# Altium schematic sheet connector.SchDoc
size A4; SheetNumber: 2; SheetTotal: 4
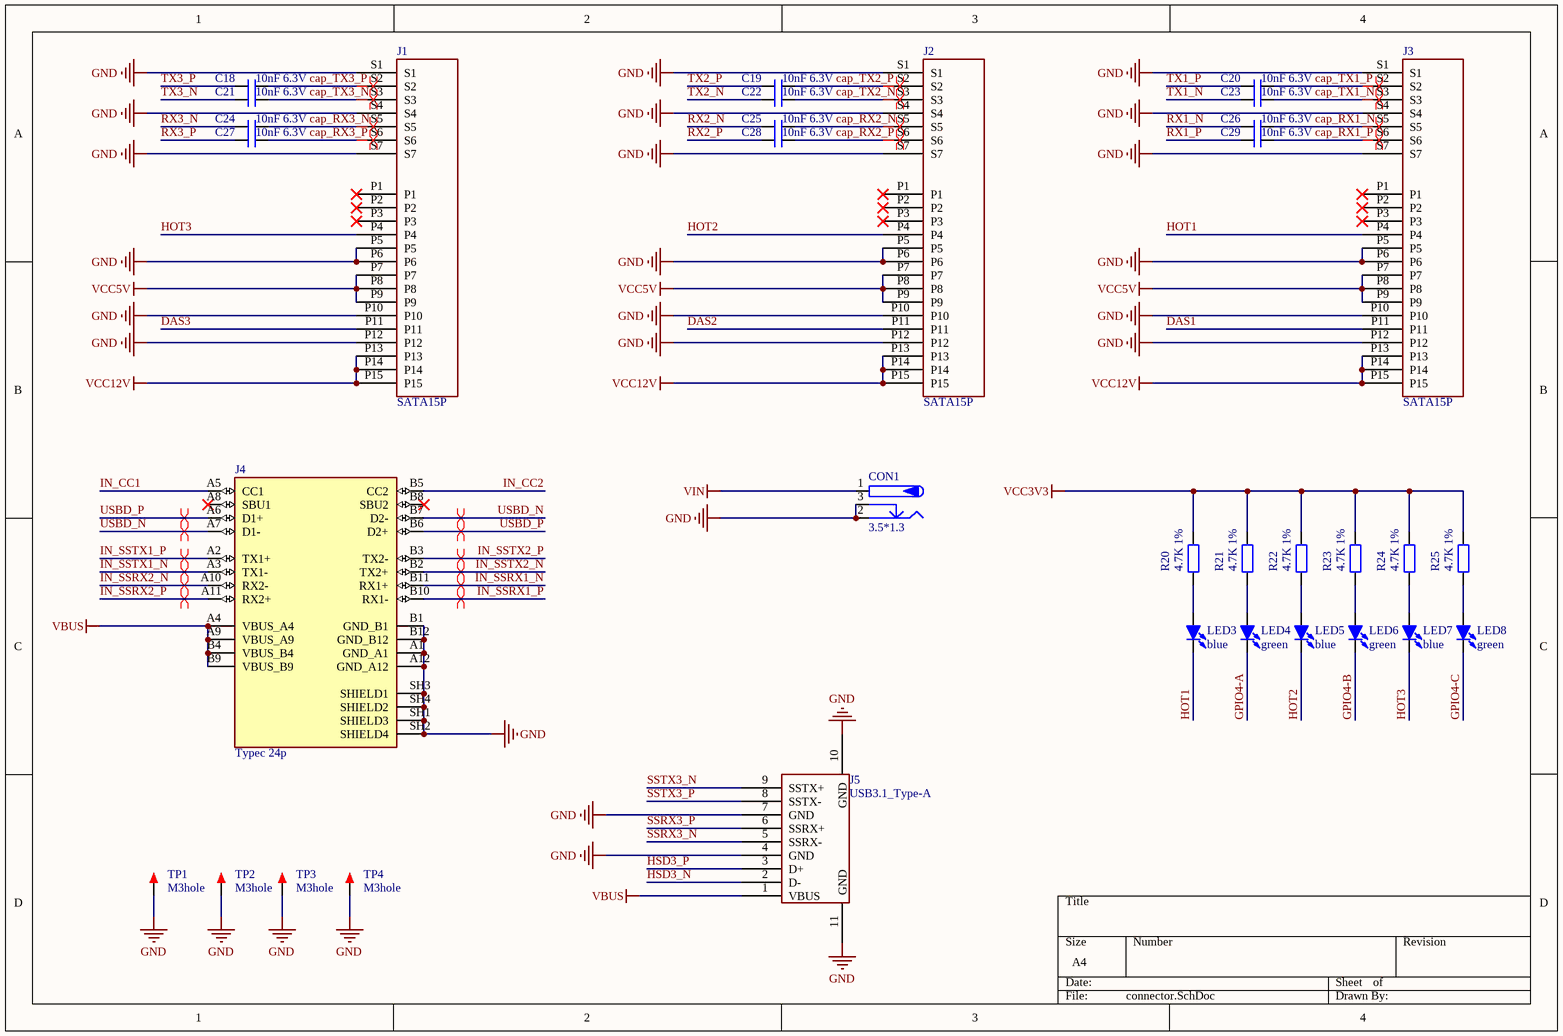
[diagram p0: connector.SchDoc]

## Parts
C18  10nF 6.3V  [C0402_L]
C19  10nF 6.3V  [C0402_L]
C20  10nF 6.3V  [C0402_L]
C21  10nF 6.3V  [C0402_L]
C22  10nF 6.3V  [C0402_L]
C23  10nF 6.3V  [C0402_L]
C24  10nF 6.3V  [C0402_L]
C25  10nF 6.3V  [C0402_L]
C26  10nF 6.3V  [C0402_L]
C27  10nF 6.3V  [C0402_L]
C28  10nF 6.3V  [C0402_L]
C29  10nF 6.3V  [C0402_L]
CON1  3.5*1.3  [DC-012]
J1  SATA15P  [SATA 15P 贴片]
J2  SATA15P  [SATA 15P 贴片]
J3  SATA15P  [SATA 15P 贴片]
J4  Typec 24p  [TypeC 24p 直立]
J5  USB3.1_Type-A  [USB3.1_Type-A 立式直插]
LED3  blue  [LED 0805B]
LED4  green  [LED 0805G]
LED5  blue  [LED 0805B]
LED6  green  [LED 0805G]
LED7  blue  [LED 0805B]
LED8  green  [LED 0805G]
R20  4.7K 1%  [R0402_L]
R21  4.7K 1%  [R0402_L]
R22  4.7K 1%  [R0402_L]
R23  4.7K 1%  [R0402_L]
R24  4.7K 1%  [R0402_L]
R25  4.7K 1%  [R0402_L]
TP1  M3hole  [m3内嵌螺母贴片]
TP2  M3hole  [m3内嵌螺母贴片]
TP3  M3hole  [m3内嵌螺母贴片]
TP4  M3hole  [m3内嵌螺母贴片]

## Nets
GND: CON1.2 CON1.3 J1.P5 J1.P6 J1.P10 J1.P12 J1.S1 J1.S4 J1.S7 J2.P5 J2.P6 J2.P10 J2.P12 J2.S1 J2.S4 J2.S7 J3.P5 J3.P6 J3.P10 J3.P12 J3.S1 J3.S4 J3.S7 J4.A1(GND_A1) J4.A12(GND_A12) J4.B1(GND_B1) J4.B12(GND_B12) J4.SH1(SHIELD3) J4.SH2(SHIELD4) J4.SH3(SHIELD1) J4.SH4(SHIELD2) J5.4(GND) J5.7(GND) J5.10(GND) J5.11(GND) TP1.1 TP2.1 TP3.1 TP4.1
VBUS: J4.A4(VBUS_A4) J4.A9(VBUS_A9) J4.B4(VBUS_B4) J4.B9(VBUS_B9) J5.1(VBUS)
VCC3V3: R20.1 R21.1 R22.1 R23.1 R24.1 R25.1
VCC5V: J1.P7 J1.P8 J1.P9 J2.P7 J2.P8 J2.P9 J3.P7 J3.P8 J3.P9
VCC12V: J1.P13 J1.P14 J1.P15 J2.P13 J2.P14 J2.P15 J3.P13 J3.P14 J3.P15
VIN: CON1.1
cap_RX1_N: C26.1 J3.S5
cap_RX1_P: C29.1 J3.S6
cap_RX2_N: C25.1 J2.S5
cap_RX2_P: C28.1 J2.S6
cap_RX3_N: C24.1 J1.S5
cap_RX3_P: C27.1 J1.S6
cap_TX1_N: C23.1 J3.S3
cap_TX1_P: C20.1 J3.S2
cap_TX2_N: C22.1 J2.S3
cap_TX2_P: C19.1 J2.S2
cap_TX3_N: C21.1 J1.S3
cap_TX3_P: C18.1 J1.S2
DAS1: J3.P11
DAS2: J2.P11
DAS3: J1.P11
GPIO4-A: LED4.2(K)
GPIO4-B: LED6.2(K)
GPIO4-C: LED8.2(K)
HOT1: J3.P4 LED3.2(K)
HOT2: J2.P4 LED5.2(K)
HOT3: J1.P4 LED7.2(K)
HSD3_N: J5.2(D-)
HSD3_P: J5.3(D+)
IN_CC1: J4.A5(CC1)
IN_CC2: J4.B5(CC2)
IN_SSRX1_N: J4.B11(RX1+)
IN_SSRX1_P: J4.B10(RX1-)
IN_SSRX2_N: J4.A10(RX2-)
IN_SSRX2_P: J4.A11(RX2+)
IN_SSTX1_N: J4.A3(TX1-)
IN_SSTX1_P: J4.A2(TX1+)
IN_SSTX2_N: J4.B2(TX2+)
IN_SSTX2_P: J4.B3(TX2-)
RX1_N: C26.2
RX1_P: C29.2
RX2_N: C25.2
RX2_P: C28.2
RX3_N: C24.2
RX3_P: C27.2
SSRX3_N: J5.5(SSRX-)
SSRX3_P: J5.6(SSRX+)
SSTX3_N: J5.9(SSTX+)
SSTX3_P: J5.8(SSTX-)
TX1_N: C23.2
TX1_P: C20.2
TX2_N: C22.2
TX2_P: C19.2
TX3_N: C21.2
TX3_P: C18.2
USBD_N: J4.A7(D1-) J4.B7(D2-)
USBD_P: J4.A6(D1+) J4.B6(D2+)
NetLED3_1: LED3.1(A) R20.2
NetLED4_1: LED4.1(A) R21.2
NetLED5_1: LED5.1(A) R22.2
NetLED6_1: LED6.1(A) R23.2
NetLED7_1: LED7.1(A) R24.2
NetLED8_1: LED8.1(A) R25.2

Not connected (* = marked no-connect by the designer): J1 P1* P2* P3*; J2 P1* P2* P3*; J3 P1* P2* P3*; J4 A8(SBU1)* B8(SBU2)*

## Layout directives
differential pair: cap_RX1_N, cap_RX1_P, cap_RX2_N, cap_RX2_P, cap_RX3_N, cap_RX3_P, cap_TX1_N, cap_TX1_P, cap_TX2_N, cap_TX2_P, cap_TX3_N, cap_TX3_P, IN_SSRX1_N, IN_SSRX1_P, IN_SSRX2_N, IN_SSRX2_P, IN_SSTX1_N, IN_SSTX1_P, IN_SSTX2_N, IN_SSTX2_P, USBD_N, USBD_P

## Library data of the parts
C18-C29 = C: 无极性贴片电容; 版权归属: 源创客; 材质: X7R; BOM名称: 无极性贴片电容; 学习资源: www.ooocke.com
CON1 = P-DC: 低压电源接口; BOM名称: DC电源接口; 版权归属: 源创客; 学习资源: www.ooocke.com
J4 = Typec 24p: USB-C (USB TYPE-C) USB 3.2 Gen 2 (USB 3.1 Gen 2, Superspeed + (USB 3.1)) Receptacle Connector 24 Position Surface Mount, Right Angle; Through Hole; MF: Molex; MP: 1054500101; SnapEDA_Link: https://www.snapeda.com/parts/1054500101/Molex/view-part/?ref=snap; Package: None; Value: *; Check_prices: https://www.snapeda.com/parts/1054500101/Molex/view-part/?ref=eda
J5 = USB3.1_Type-A: USB接口
LED3-LED8 = LED-3MM: 插件LED; 版权归属: 源创客; BOM名称: 插件LED; 学习资源: www.ooocke.com
R20-R25 = R: 贴片电阻; 版权归属: 源创客; BOM名称: 贴片电阻; 学习资源: www.ooocke.com
TP1-TP4 = TEST: 测试点; 版权归属: 源创客; BOM名称: 测试点; 学习资源: www.ooocke.com